# EAGLE design sunburn-monitor-v2 (EAGLE 6.5.0)
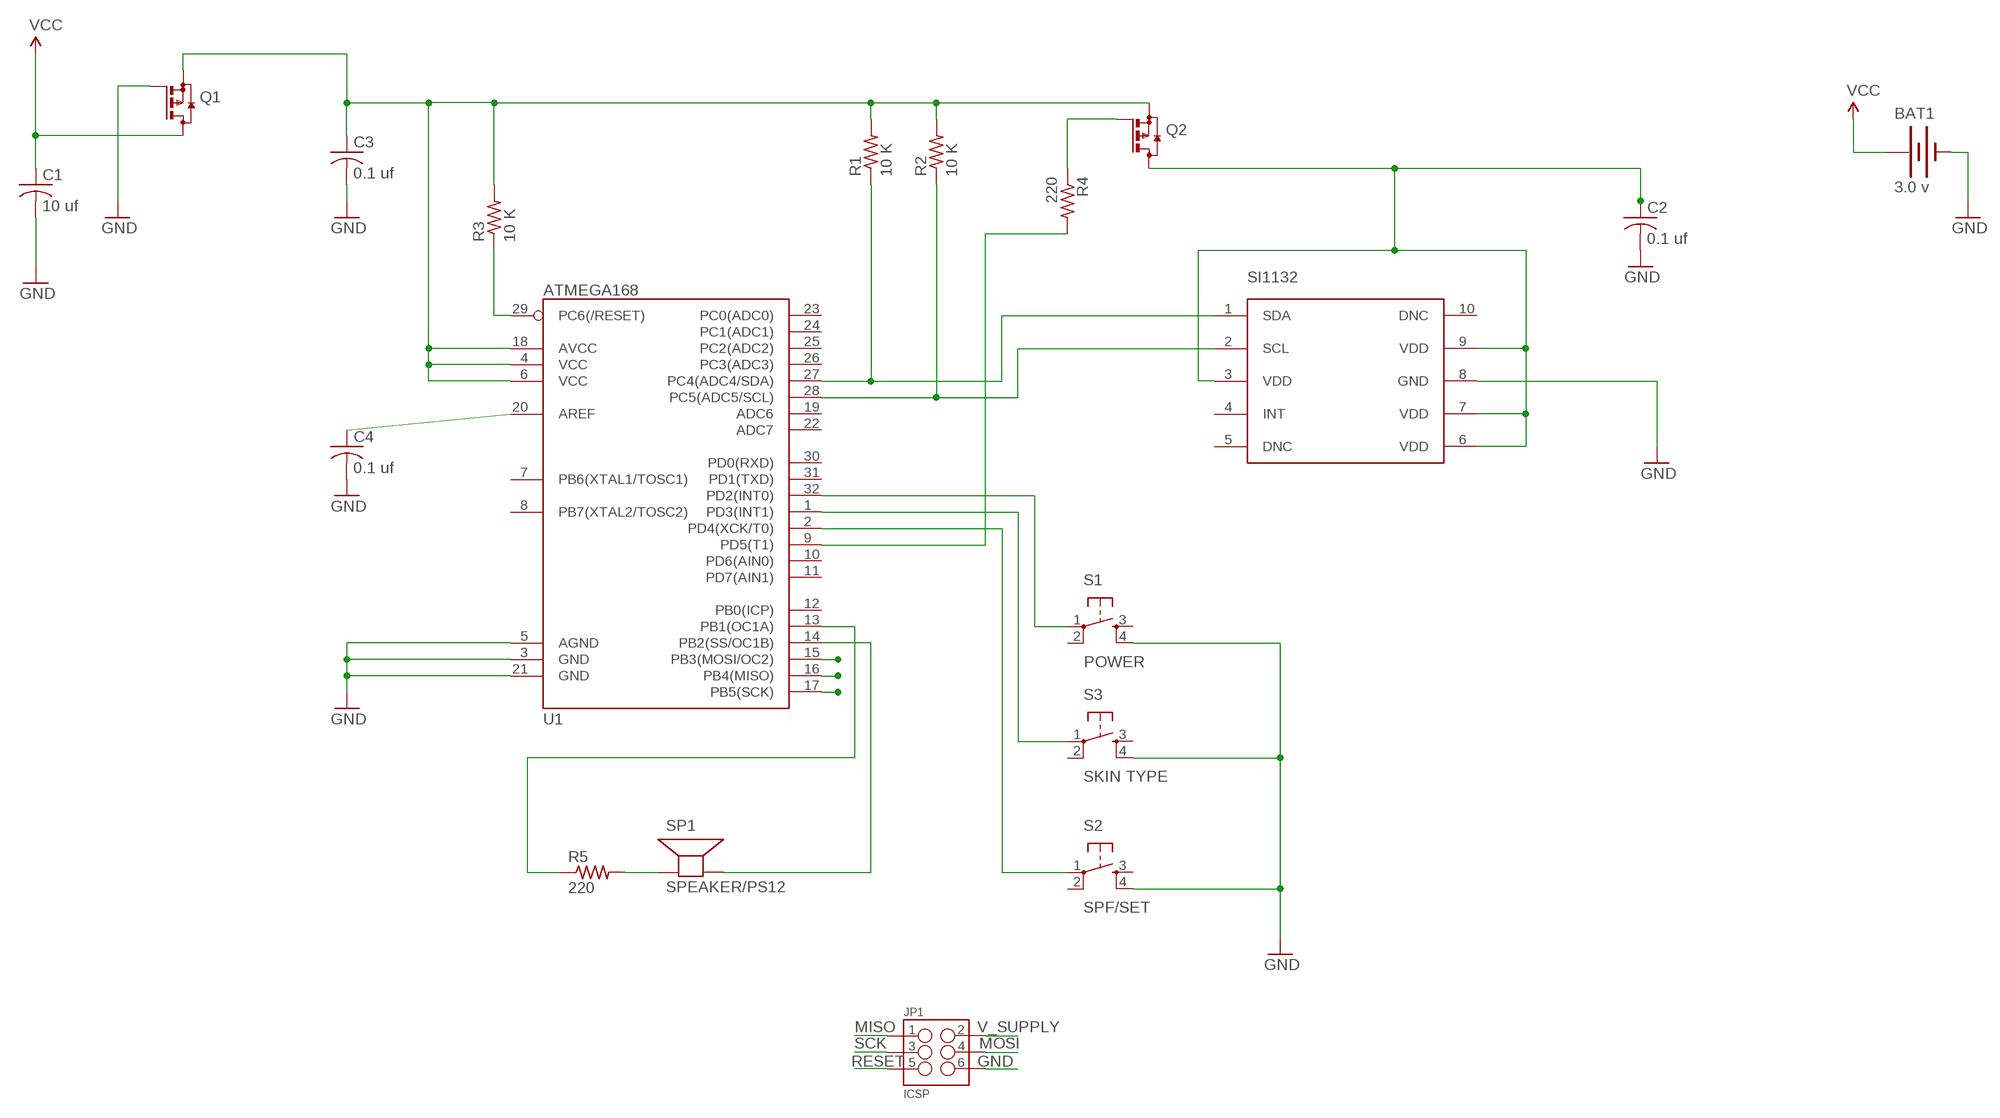
[diagram p0: schematic, sheet 1]

## Parts
BAT1  3.0 v  BATTERY20SMD  [BATTCON_20MM]
C1  10 uf  C-USC2012  [C2012]
C2  0.1 uf  C-USC2012  [C2012]
C3  0.1 uf  C-USC2012  [C2012]
C4  0.1 uf  C-USC2012  [C2012]
JP1  ICSP  M03X2NO_SILK  [2X3-NS]
Q1  SI2333DDS  [SOT23]
Q2  SI2333DDS  [SOT23]
R1  10 K  R-US_R2012  [R2012]
R2  10 K  R-US_R2012  [R2012]
R3  10 K  R-US_R2012  [R2012]
R4  220  R-US_R2012  [R2012]
R5  220  R-US_R2012  [R2012]
S1  POWER  TAC_SWITCHSMD  [TACTILE_SWITCH_SMD]
S2  SPF/SET  TAC_SWITCHSMD  [TACTILE_SWITCH_SMD]
S3  SKIN TYPE  TAC_SWITCHSMD  [TACTILE_SWITCH_SMD]
SP1  SPEAKER/PS12  [PS12]
U1  ATMEGA168  [TQFP32-08]
U2  SI1132  [QFN-10]

## Nets
GND: BAT1.2(-) C1.2 C2.2 C3.2 C4.2 JP1.6 Q1.1(G) S1.4 S2.4 S3.4 U1.3(GND) U1.5(AGND) U1.21(GND) U2.8(GND)
MISO: JP1.1 U1.16(PB4(MISO))
MOSI: JP1.4 U1.15(PB3(MOSI/OC2))
N$1: R1.1 U1.27(PC4(ADC4/SDA)) U2.1(SDA)
N$2: C4.1 U1.20(AREF)
N$4: R2.1 U1.28(PC5(ADC5/SCL)) U2.2(SCL)
N$5: C2.1 Q2.3(D) U2.3(VDD) U2.6(VDD) U2.7(VDD) U2.9(VDD)
N$6: Q2.1(G) R4.1
N$7: S1.1 U1.32(PD2(INT0))
N$8: S3.1 U1.1(PD3(INT1))
N$9: S2.1 U1.2(PD4(XCK/T0))
N$10: R4.2 U1.9(PD5(T1))
N$11: R5.1 U1.13(PB1(OC1A))
N$12: R5.2 SP1.P$1(+)
N$13: SP1.P$2(-) U1.14(PB2(SS/OC1B))
RESET: JP1.5 R3.1 U1.29(PC6(/RESET))
SCK: JP1.3 U1.17(PB5(SCK))
V_SUPPLY: C3.1 JP1.2 Q1.2(S) Q2.2(S) R1.2 R2.2 R3.2 U1.4(VCC) U1.6(VCC) U1.18(AVCC)
VCC: BAT1.1(+) C1.1 Q1.3(D)
Unconnected: S1.2 S1.3 S2.2 S2.3 S3.2 S3.3 U1.7(PB6(XTAL1/TOSC1)) U1.8(PB7(XTAL2/TOSC2)) U1.10(PD6(AIN0)) U1.11(PD7(AIN1)) U1.12(PB0(ICP)) U1.19(ADC6) U1.22(ADC7) U1.23(PC0(ADC0)) U1.24(PC1(ADC1)) U1.25(PC2(ADC2)) U1.26(PC3(ADC3)) U1.30(PD0(RXD)) U1.31(PD1(TXD)) U2.4(INT) U2.5(DNC) U2.10(DNC)

## Library data of the parts
BAT1 = SparkFun-Electromechanical:BATTERY: Battery Holders Various common sizes : AA, AAA, 20mm coin cell and 12mm coin cell. 20MM_4LEGS, BATT-10373
C1-C4 = adafruit:C-US: CAPACITOR, American symbol
JP1 = SparkFun-Connectors:M03X2: 2x3 .1" header. Shrouded, with keying- CONN-10681 SMT- CONN-11415 Pogo pins- HW-11044
Q1 Q2 = alex-parts:SI2333DDS: SI2333DDS-T1-GE3 - p-channel MOSFET
R1-R5 = adafruit:R-US_: RESISTOR, American symbol
S1-S3 = SparkFun-Electromechanical:TAC_SWITCH: Momentary Switch Button commonly used for reset or general input. Spark Fun Electronics SKU : COM-00097 SMT- SWCH-08247; PROD_ID: SWCH-08247
SP1 = adafruit:SPEAKER: SPEAKER Source: Buerklin Added PS12 (for part # PS1240 piezo) http://www.ladyada.net/library/pcb/eaglelibrary.html
U1 = SparkFun-DigitalIC:ATMEGA168: Atmel 32-pin 8-bit micro, 16k flash.
U2 = alex-parts:SI1132: SI1132 UV/IR/Visible light sensor i2c protocol 3.3v

## Board
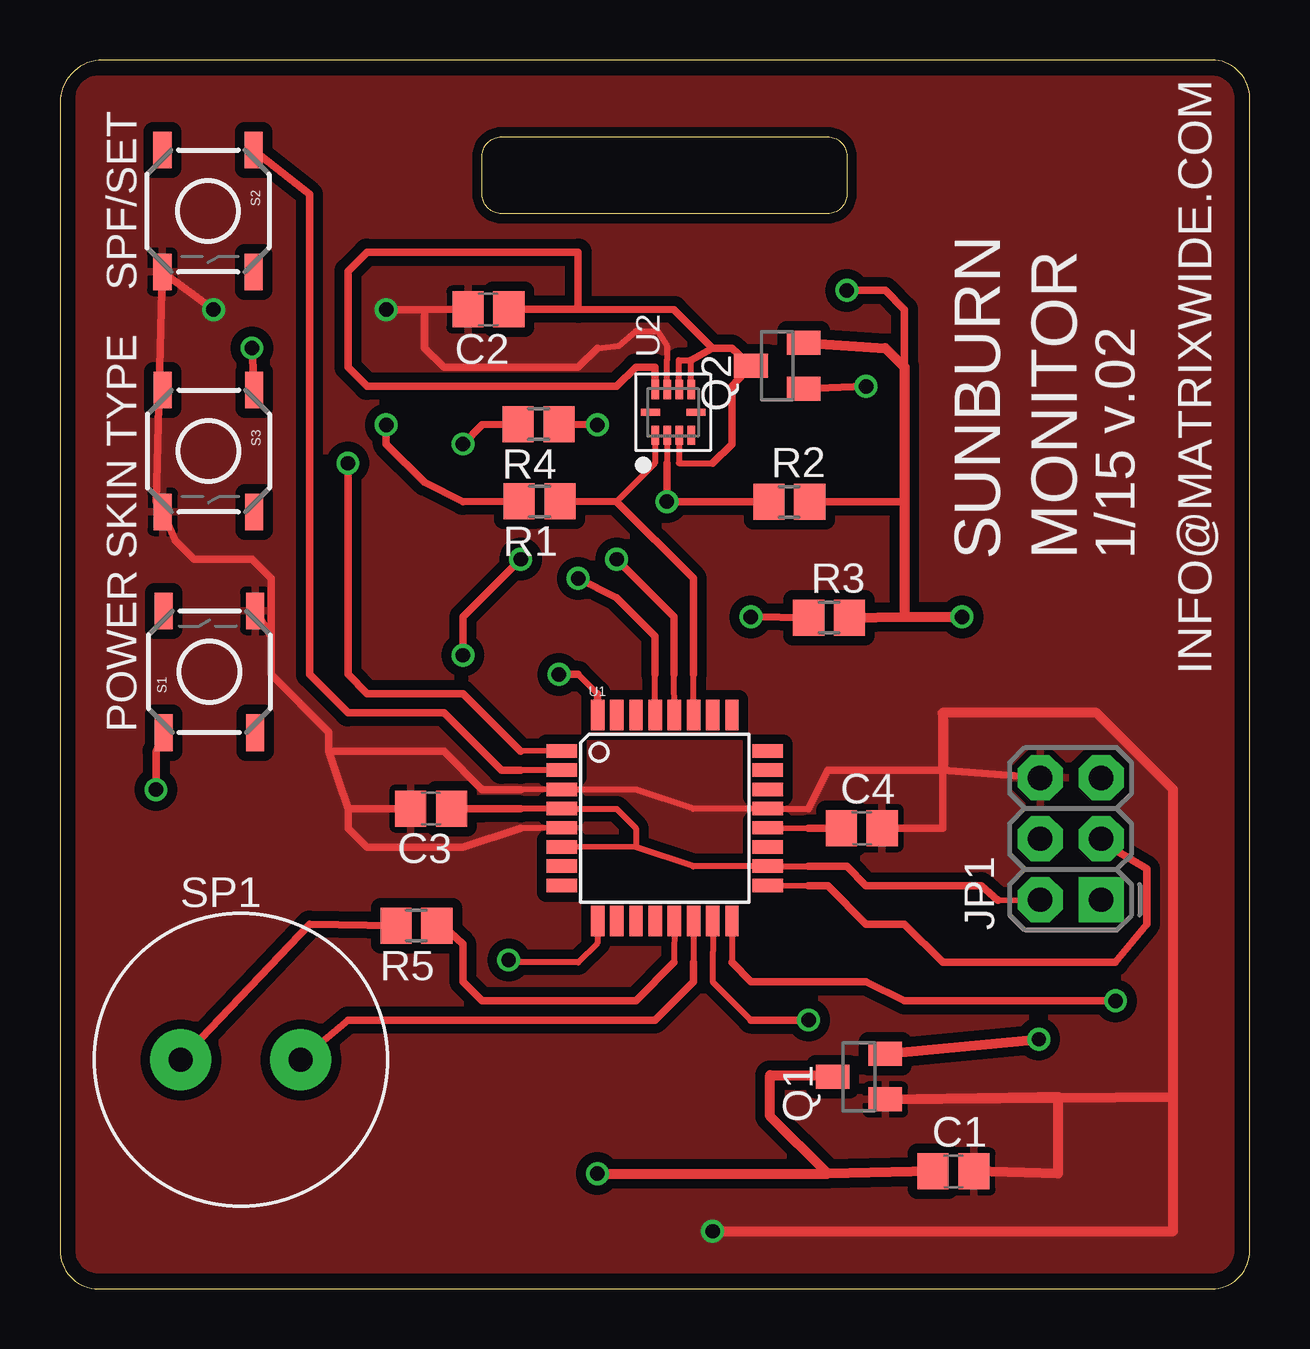
[diagram p1: board, top side]
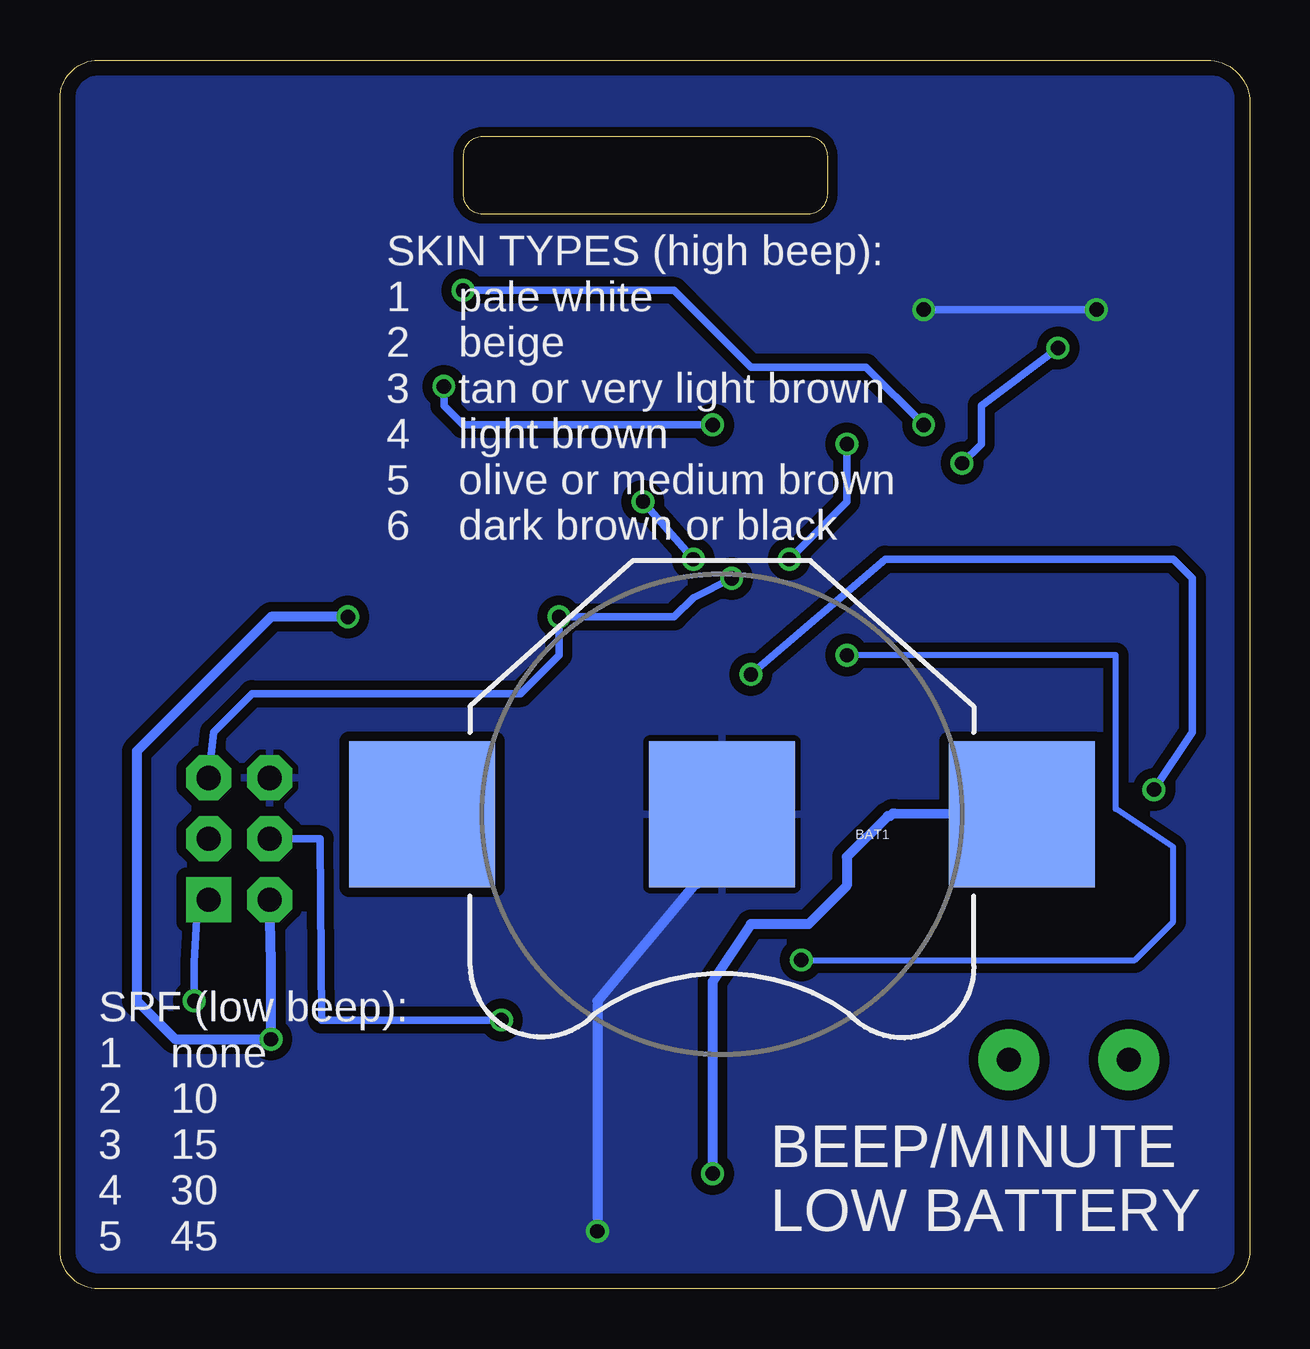
[diagram p2: board, bottom side, seen from below]

Size 49.6 x 51.2 mm. Coordinates in mm from the lower left corner, seen from the top.
Outline: 49.6,1.6 49.6,49.6 arc90 48,51.2 1.79,51.2 arc90 0,49.41 0,1.6 arc90 1.6,0 48,0 arc90 49.6,1.6
Outline: 32,44.8 18.4,44.8 arc-90 17.6,45.6 17.6,47.2 arc-90 18.4,48 32,48 arc-90 32.8,47.2 32.8,45.6 arc-90 32,44.8
Copper layers (1*16): Top 0.0356mm / dielectric 1.5011mm / Bottom 0.0356mm
Design rules "OSHPark": minimum track width 6mil, minimum drill 13mil, track to track 6mil, track to pad 6mil, pad to pad 6mil, via to via 6mil, smd to smd 6mil, copper to edge 15mil, drill to drill 6mil, minimum pad ring 7mil, minimum via ring 7mil, stop-mask expansion 3mil, vias tented up to drill 0mil, thermal gap 10mil

### Footprints (pad centres in the part's own frame; a part is rotated, then mirrored left to right if it is on the bottom)
BATTCON_20MM = smd 6.07 x 6.07: 1 -12.5,0; 2 0,0; 3 12.5,0
C2012 = smd 1.3 x 1.5: 1 -0.85,0; 2 0.85,0
2X3-NS = drill 1.016 pad 1.88 square: 1 -2.54,-1.27 | drill 1.016 pad 1.88 octagon: 2 -2.54,1.27; 3 0,-1.27; 4 0,1.27; 5 2.54,-1.27; 6 2.54,1.27
SOT23 = smd 1 x 1.4: 1 -0.95,-1.1; 2 0.95,-1.1; 3 0,1.1
R2012 = smd 1.3 x 1.5: 1 -0.85,0; 2 0.85,0
TACTILE_SWITCH_SMD = smd 1.524 x 0.762: 1 -2.54,1.905; 2 2.54,1.905; 3 -2.54,-1.905; 4 2.54,-1.905
PS12 = drill 1 pad 2.54: P$1 -2.5,0; P$2 2.5,0
TQFP32-08 = smd 1.27 x 0.559: 1 -4.293,2.8; 2 -4.293,2; 3 -4.293,1.2; 4 -4.293,0.4; 5 -4.293,-0.4; 6 -4.293,-1.2; 7 -4.293,-2; 8 -4.293,-2.8; 17 4.293,-2.8; 18 4.293,-2; 19 4.293,-1.2; 20 4.293,-0.4; 21 4.293,0.4; 22 4.293,1.2; 23 4.293,2; 24 4.293,2.8 | smd 0.559 x 1.27: 9 -2.8,-4.293; 10 -2,-4.293; 11 -1.2,-4.293; 12 -0.4,-4.293; 13 0.4,-4.293; 14 1.2,-4.293; 15 2,-4.293; 16 2.8,-4.293; 25 2.8,4.293; 26 2,4.293; 27 1.2,4.293; 28 0.4,4.293; 29 -0.4,4.293; 30 -1.2,4.293; 31 -2,4.293; 32 -2.8,4.293
QFN-10 = smd 0.8 x 0.3: 1 -0.95,-0.2; 2 -0.95,-0.7; 3 -0.95,-1.2; 4 -0.95,-1.7; 6 0.95,-1.7; 7 0.95,-1.2; 8 0.95,-0.7; 9 0.95,-0.2 | smd 0.3 x 0.8: 5 0,-1.9; 10 0,0

### Placement (x,y rotation side)
BAT1  22.01,19.77 180 bottom
C1  37.24,4.89 0 top
C2  17.86,40.81 180 top
C3  15.47,20.01 180 top
C4  33.42,19.19 0 top
JP1  42.13,18.75 90 top
Q1  33.3,8.84 90 top
Q2  29.9,38.46 90 top
R1  19.99,32.81 180 top
R2  30.4,32.79 0 top
R3  32.06,27.97 0 top
R4  19.95,36.03 180 top
R5  14.86,15.13 180 top
S1  6.23,25.71 90 top
S2  6.17,44.91 270 top
S3  6.19,34.91 270 top
SP1  7.54,9.54 0 top
U1  25.21,19.61 0 top
U2  24.61,36.52 90 top

### Tracks (layer width: path | path; a pad name or v marks a point on that pad's centre or on a via)
GND  (via drill 0.6)
  Top 0.254: U2.8 25.3,38.7 25.3,39.3 24.9,39.9 24,39.9 23.3,39.3 22.4,39.2 | 31.2,20 U1.21 26.4,20 24,20.8 21.6,20.8 U1.3 19.2,20.8 | U1.5 20,19.2 19.2,19.2 U1.5
  Top 0.305: 31.2,20 32,21.6 36.8,21.6 | JP1.6 36.8,21.6 | C4.2 36.8,19.2 36.8,21.6 | C3.2 12,20 | 12,20 11.2,22.4 | 11.2,22.4 11.2,23.2 8.8,25.6 8.8,27.2 | S1.4 8.8,27.2 | 8.8,27.2 8.8,29.6 8,30.4 5.6,30.4 4.8,31.2 S3.4 4,32.8 S2.4 v6.4,40.8 | 19.2,20.8 17.6,20.8 16,22.4 11.2,22.4 | 19.2,19.2 16.8,18.4 12.8,18.4 12,19.2 12,20 | v13.6,40.8 15.2,40.8 | C2.2 15.2,40.8 | 15.2,40.8 15.2,39.2 16,38.4 21.6,38.4 22.4,39.2
  Top 0.406: v27.2,2.4 46.4,2.4 46.4,8 | 46.4,8 46.4,20.8 43.2,24 36.8,24 36.8,21.6 | 46.4,8 Q1.1 40.8,8 41.6,8 41.6,4.8 C1.2
  Bottom 0.305: v6.4,40.8 v13.6,40.8
  Bottom 0.406: BAT1.2 22.01,17.21 23.2,16.8 27.2,12 v27.2,2.4
  pour Bottom (isolate 0.406): 48,0.8 1.6,0.8 arc-90 0.8,1.6 0.8,49.6 arc-90 1.6,50.4 48,50.4 arc-90 48.8,49.6 48.8,1.6 arc-90
  pour Top (isolate 0.406): 48,0.8 1.6,0.8 arc-90 0.8,1.6 0.8,49.6 arc-90 1.6,50.4 48,50.4 arc-90 48.8,49.6 48.8,1.6 arc-90
MISO  (via drill 0.6)
  Top 0.254: U1.16 28,13.6
  Top 0.305: 28,13.6 28.8,12.8 33.6,12.8 35.2,12 v44,12
  Bottom 0.305: v44,12 44,13.6 43.9,15.4 JP1.1
MOSI  (via drill 0.6)
  Top 0.254: 27.2,15.2 U1.15 27.2,12.8 28.8,11.2
  Top 0.305: 28.8,11.2 v31.2,11.2
  Bottom 0.305: v31.2,11.2 38.7,11.2 38.75,18.75 JP1.4
N$1
  Top 0.254: U2.1 24.8,34.4 23.2,32.8 | U1.27 26.4,25.6
  Top 0.305: 26.4,25.6 26.4,29.6 23.2,32.8 R1.1
N$2
  Top 0.254: U1.20 31.2,19.2
  Top 0.305: 31.2,19.2 C4.1
N$4  (via drill 0.6)
  Top 0.254: U2.2 25.3,34.4 | U1.28 25.6,25.6
  Top 0.305: 25.3,34.4 v25.3,32.8 R2.1 | v23.2,30.4 25.6,28 25.6,25.6
  Bottom 0.305: v25.3,32.8 v23.2,30.4
N$5
  Top 0.254: U2.6 26.3,38.7 25.8,38.7 U2.7 | U2.9 24.8,37.9 | U2.3 25.8,34.4 27.2,34.4
  Top 0.305: 26.3,38.7 27.2,39.2 | 27.2,39.2 28,39.2 Q2.3 28,37.6 28,35.2 27.2,34.4 | 27.2,39.2 25.6,40.8 21.6,40.81 | 21.6,40.81 C2.1 | U2.9 24.8,37.6 24.8,38.4 24,38.4 23.2,37.6 12.8,37.6 12,38.4 12,42.4 12.8,43.2 21.6,43.2 21.6,40.81
N$6  (via drill 0.6)
  Top 0.305: R4.1 v22.4,36 | v33.6,37.6 Q2.1
  Bottom 0.305: v22.4,36 32.8,36 33.6,36.8 v33.6,37.6
N$7  (via drill 0.6)
  Top 0.254: 22.4,24.8 21.6,25.6
  Top 0.305: U1.32 22.4,24.8 | 21.6,25.6 v20.8,25.6 | S1.1 4,22.4 v4,20.8
  Bottom 0.305: v20.8,25.6 15.2,30.4 3.2,30.4 2.4,29.6 2.4,23.2 v4,20.8
N$8  (via drill 0.6)
  Top 0.254: U1.1 19.2,22.4
  Top 0.305: 19.2,22.4 16.8,24.8 12.8,24.8 12,25.6 v12,34.4 | v8,39.2 S3.1
  Bottom 0.305: v12,34.4 11.2,35.2 11.2,36.8 v8,39.2
N$9
  Top 0.254: U1.2 19.2,21.6
  Top 0.305: 19.2,21.6 18.4,21.6 16,24 12,24 10.4,25.6 10.4,45.6 S2.1
N$10  (via drill 0.6)
  Top 0.254: U1.9 22.4,14.4 21.6,13.6 18.7,13.6 v18.7,13.7
  Top 0.305: v16.8,35.2 17.6,36 R4.2 | v16.8,26.4 16.8,28 v19.2,30.4
  Bottom 0.254: v18.7,13.7 4.8,13.7 3.2,15.3 3.2,18.4 5.6,20 5.6,26.4 v16.8,26.4
  Bottom 0.305: v19.2,30.4 16.8,32.8 v16.8,35.2
N$11
  Top 0.254: U1.13 25.6,13.6
  Top 0.305: 25.6,13.6 24,12 17.6,12 16.8,12.8 16.8,14.35 15.95,15.15 R5.1
N$12
  Top 0.305: R5.2 10.4,15.2 SP1.P$1
N$13
  Top 0.254: U1.14 26.4,13.6
  Top 0.305: 26.4,13.6 26.4,12.8 24.8,11.2 12,11.2 SP1.P$2
RESET  (via drill 0.6)
  Top 0.254: U1.29 24.8,25.6
  Top 0.305: 24.8,25.6 24.8,27.2 23.2,28.8 v21.6,29.6 | R3.1 v28.8,28
  Bottom 0.305: v21.6,29.6 23.2,28.8 24,28 v28.8,28 28.8,26.4 30.4,24.8 41.6,24.8 43.2,23.2 JP1.5
SCK
  Top 0.254: U1.17 31.2,16.8
  Top 0.305: 31.2,16.8 32,16.8 33.6,15.2 35.2,15.2 36.8,13.6 44,13.6 45.3,15.2 45.3,17.5 43.3,18.7 JP1.3
V_SUPPLY  (via drill 0.6)
  Top 0.254: 19.2,20 U1.4 23.2,20 24,19.2 24,18.4 | 31.2,17.6 U1.18 26.4,17.6 24,18.4 | 39.1,16.2 JP1.2 | 24,18.4 U1.6
  Top 0.305: 31.2,17.6 32.8,17.6 33.6,16.8 38.4,16.8 39.1,16.2 | 19.2,20 17.6,20 C3.1 | R2.2 35.2,32.8 | R1.2 16.8,32.8 15.2,33.6 13.6,35.2 v13.6,36 | v32.8,41.6 34.4,41.6 35.2,40.8 35.2,38.4
  Top 0.406: Q1.2 v40.8,10.4 | Q2.2 34.4,39.2 35.2,38.4 35.2,32.8 35.2,28 | R3.2 35.2,28 | 35.2,28 v37.6,28
  Bottom 0.305: v13.6,36 16,38.4 20.8,38.4 24,41.6 v32.8,41.6
  Bottom 0.406: JP1.2 40.8,13.6 v40.8,10.4 44.8,10.4 46.4,12 46.4,22.4 40.8,28 v37.6,28
VCC  (via drill 0.6)
  Top 0.406: v22.4,4.8 32,4.8 | 32,4.8 29.6,7.2 29.6,8.9 32.1,8.9 Q1.3 | C1.1 32,4.8
  Bottom 0.406: BAT1.1 14.8,19.8 14.9,19.8 15,19.7 15.1,19.7 16.8,18 16.8,16.8 18.4,15.2 20.8,15.2 22.4,12.8 v22.4,4.8

### Text on the board
_tsilk: SPF/SET | SKIN TYPE | SUNBURN | MONITOR | 1/15 v.02 | INFO@MATRIXWIDE.COM | POWER
_bsilk: SKIN TYPES (high beep): / 1 pale white / 2 beige / 3 tan or very light brown / 4 light brown / 5 olive or medium brown / 6 dark brown or black | BEEP/MINUTE / LOW BATTERY | SPF (low beep): / 1 none / 2 10 / 3 15 / 4 30 / 5 45